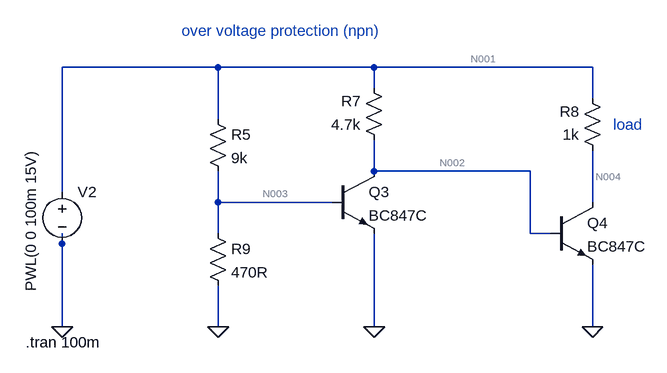
[diagram p0: schematic task 2b.asc]
task 2b.asc, the LTspice schematic file:
Version 4.1
SHEET 1 880 1064
WIRE 192 624 -48 624
WIRE 432 624 192 624
WIRE 768 624 432 624
WIRE 432 656 432 624
WIRE 768 672 768 624
WIRE 192 704 192 624
WIRE 432 784 432 736
WIRE 672 784 432 784
WIRE -48 816 -48 624
WIRE 192 832 192 784
WIRE 368 832 192 832
WIRE 768 832 768 752
WIRE 192 880 192 832
WIRE 672 880 672 784
WIRE 704 880 672 880
WIRE -48 896 -48 880
WIRE -48 1024 -48 896
WIRE 192 1024 192 960
WIRE 432 1024 432 880
WIRE 768 1024 768 928
FLAG 432 1024 0
FLAG 192 1024 0
FLAG -48 1024 0
FLAG 768 1024 0
SYMBOL res 176 688 R0
SYMATTR InstName R5
SYMATTR Value 9k
SYMBOL res 448 752 R180
WINDOW 0 36 76 Left 2
WINDOW 3 36 40 Left 2
SYMATTR InstName R7
SYMATTR Value 4.7k
SYMBOL res 784 768 R180
WINDOW 0 36 76 Left 2
WINDOW 3 36 40 Left 2
SYMATTR InstName R8
SYMATTR Value 1k
SYMBOL voltage -48 800 R0
WINDOW 3 -48 -49 VRight 2
WINDOW 123 0 0 Left 0
WINDOW 39 0 0 Left 0
SYMATTR InstName V2
SYMATTR Value PWL(0 0 100m 15V)
SYMBOL npn 368 784 R0
SYMATTR InstName Q3
SYMATTR Value BC847C
SYMBOL npn 704 832 R0
SYMATTR InstName Q4
SYMATTR Value BC847C
SYMBOL res 176 864 R0
SYMATTR InstName R9
SYMATTR Value 470R
TEXT 800 712 Left 2 ;load
TEXT -104 1048 Left 2 !.tran 100m
TEXT 136 568 Left 2 ;over voltage protection (npn)

The netlist it stands for:
* task 2b.asc
R5 N001 N003 9k
R7 N002 N001 4.7k
R8 N004 N001 1k
V2 N001 0 PWL(0 0 100m 15V)
Q3 N002 N003 0 0 BC847C
Q4 N004 N002 0 0 BC847C
R9 N003 0 470R
.model NPN NPN
.model PNP PNP
.lib standard.bjt
* load
.tran 100m
* over voltage protection (npn)
.backanno
.end

* Results of the author's LTspice run, read from the files saved beside the schematic
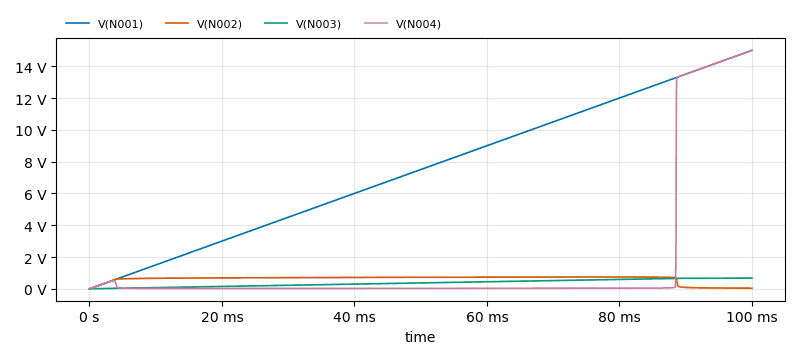
[diagram p1: Transient Analysis of task 2b.asc, plotted from the saved traces]
* Transient Analysis, 1 run:
*   V(N001): min 0 V, max 15 V, average 7.5 V, rms 8.667 V, last 15 V
*   V(N002): min 0 V, max 744.1 mV, average 622.3 mV, rms 660.4 mV, last 37.4 mV
*   V(N003): min 0 V, max 673.3 mV, average 368.1 mV, rms 423.4 mV, last 673.3 mV
*   V(N004): min 0 V, max 15 V, average 1.653 V, rms 4.782 V, last 15 V